# EAGLE design db9midi (EAGLE 9.0.0)
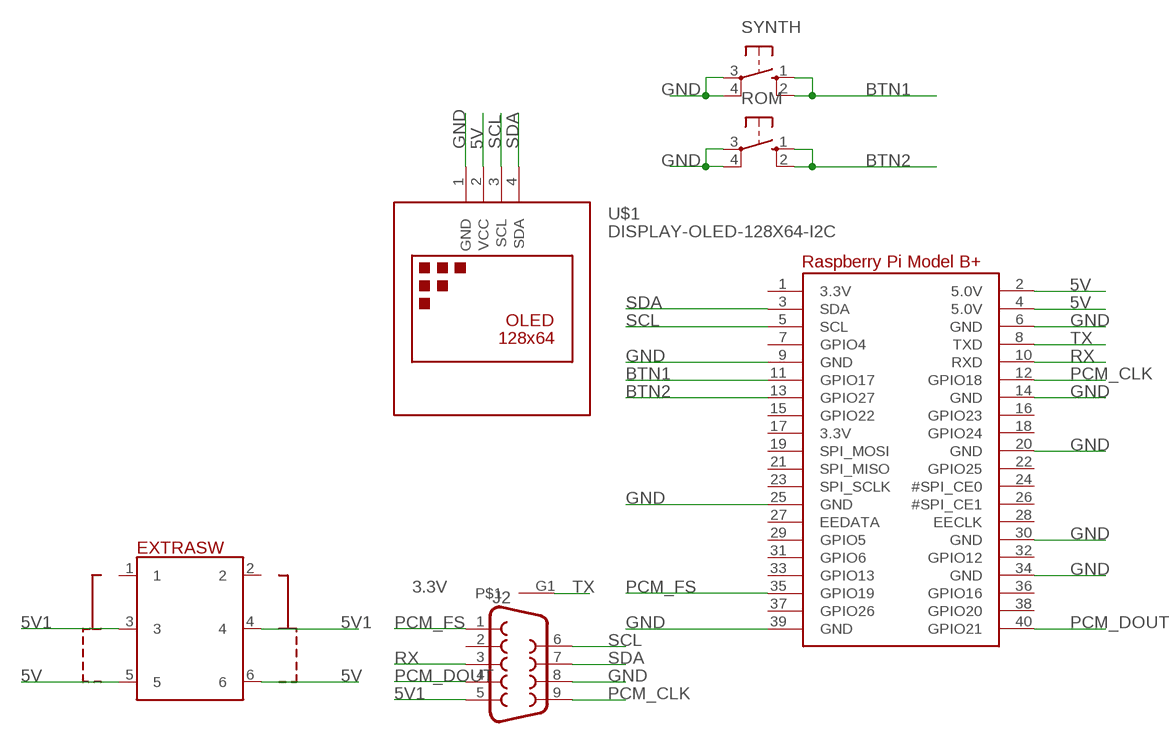
[diagram p0: schematic, sheet 1]

## Parts
EXTRASW  PS-22F03  [PS-22F03]
J2  DB9FEMALE  [DB9]
ROM  SWITCH-OMRON_10-XX  [SWITCH-OMRON_B3F-10XX]
RPI1  RASPBERRYPI_BPLUS_HATNOSLOTS  [PI_HAT_NOSLOTS]
SYNTH  SWITCH-OMRON_10-XX  [SWITCH-OMRON_B3F-10XX]
U$1  DISPLAY-OLED-128X64-I2C  [DISPLAY-OLED-128X64-I2C]

## Nets
5V: EXTRASW.5 EXTRASW.6 RPI1.2(5.0V) RPI1.4(5.0V) U$1.2(VCC)
5V1: EXTRASW.3 EXTRASW.4 J2.5
BTN1: RPI1.11(GPIO17) SYNTH.1(S) SYNTH.2(S1)
BTN2: ROM.1(S) ROM.2(S1) RPI1.13(GPIO27)
GND: J2.8 ROM.3(P) ROM.4(P1) RPI1.6(GND) RPI1.9(GND) RPI1.14(GND) RPI1.20(GND) RPI1.25(GND) RPI1.30(GND) RPI1.34(GND) RPI1.39(GND) SYNTH.3(P) SYNTH.4(P1) U$1.1(GND)
PCM_CLK: J2.9 RPI1.12(GPIO18)
PCM_DOUT: J2.4 RPI1.40(GPIO21)
PCM_FS: J2.1 RPI1.35(GPIO19)
RX: J2.3 RPI1.10(RXD)
SCL: J2.6 RPI1.5(SCL) U$1.3(SCL)
SDA: J2.7 RPI1.3(SDA) U$1.4(SDA)
TX: J2.G1 RPI1.8(TXD)
Unconnected: EXTRASW.1 EXTRASW.2 J2.2 RPI1.1(3.3V) RPI1.7(GPIO4) RPI1.15(GPIO22) RPI1.16(GPIO23) RPI1.17(3.3V) RPI1.18(GPIO24) RPI1.19(SPI_MOSI) RPI1.21(SPI_MISO) RPI1.22(GPIO25) RPI1.23(SPI_SCLK) RPI1.24(#SPI_CE0) RPI1.26(#SPI_CE1) RPI1.27(EEDATA) RPI1.28(EECLK) RPI1.29(GPIO5) RPI1.31(GPIO6) RPI1.32(GPIO12) RPI1.33(GPIO13) RPI1.36(GPIO16) RPI1.37(GPIO26) RPI1.38(GPIO20)

## Library data of the parts
EXTRASW = A03 PS-22F03:PS-22F03
J2 = SparkFun-Connectors:DB9: DB9 Connector Standard DB9 (D-Sub 9) serial connector. Can be used for CAN bus as well as RS485 and RS232. Footprint production proven. Here is the female version connector we sell at SparkFun: 9 Pin Female Serial Connector - PCB Mount <https://www.sparkfun.com/products/429> (PRT-00429) This connector has been used on the following SparkFun products: SparkFun RS232 Shifter - SMD <https://www.sparkfun.com/products/449> (PRT-00449) SparkFun RS232 Shifter SMD (No DB9) <https://www.sparkfun.com/products/8780> (PRT-08780); PROD_ID: CONN-08194
ROM SYNTH = mister_io_usb:SWITCH-OMRON_10-XX: OMRON SWITCH; MPN: B3F-1000; OC_FARNELL: 176432; OC_NEWARK: 36M3542
RPI1 = microbuilder:RASPBERRYPI_BPLUS
U$1 = diy-modules:DISPLAY-OLED-128X64-I2C: 128x64 Dot Matrix OLED Module based on SSD1306 chip Variant with I2C interface More details available here: http://www.instructables.com/id/Monochrome-096-i2c-OLED-display-with-arduino-SSD13/ SSD1306 datasheet: https://cdn-shop.adafruit.com/datasheets/SSD1306.pdf Click here to find device on ebay.com <http://www.ebay.com/sch/oled+display+128x64+iic> Note: There are two variants: I2C and SPI. Search for the proper version.

## Net classes
1 GND: width 0.254 mm
2 VCC: width 0.254 mm

## Board
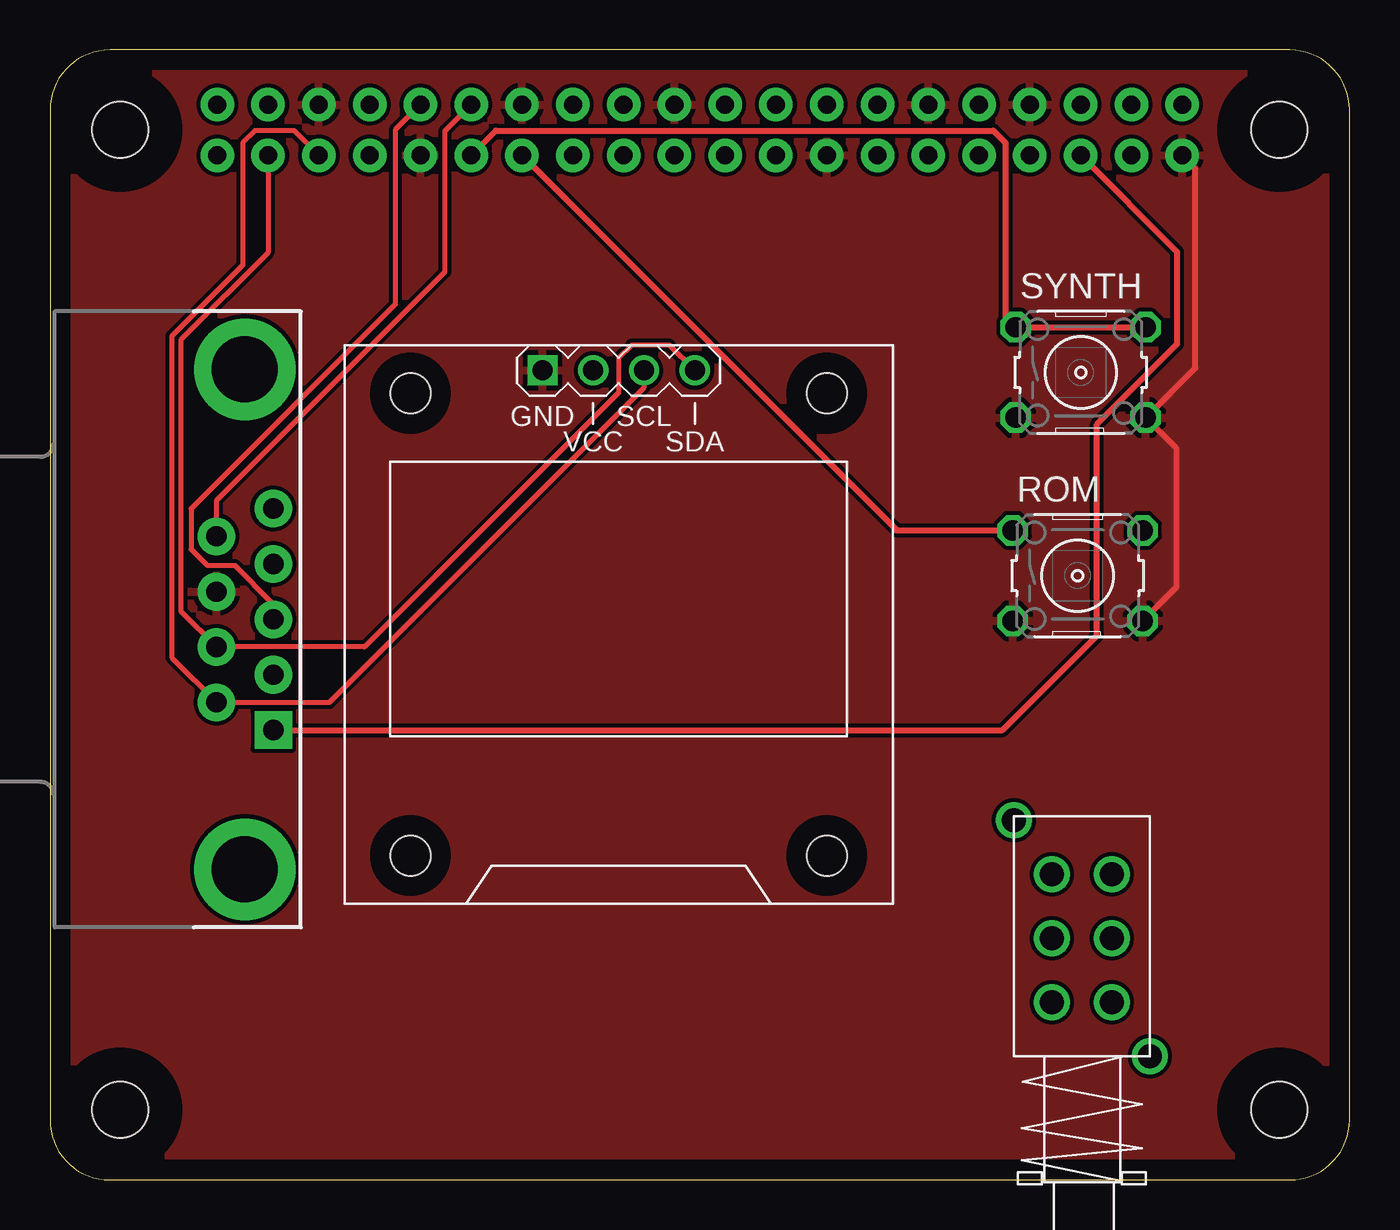
[diagram p1: board, top side]
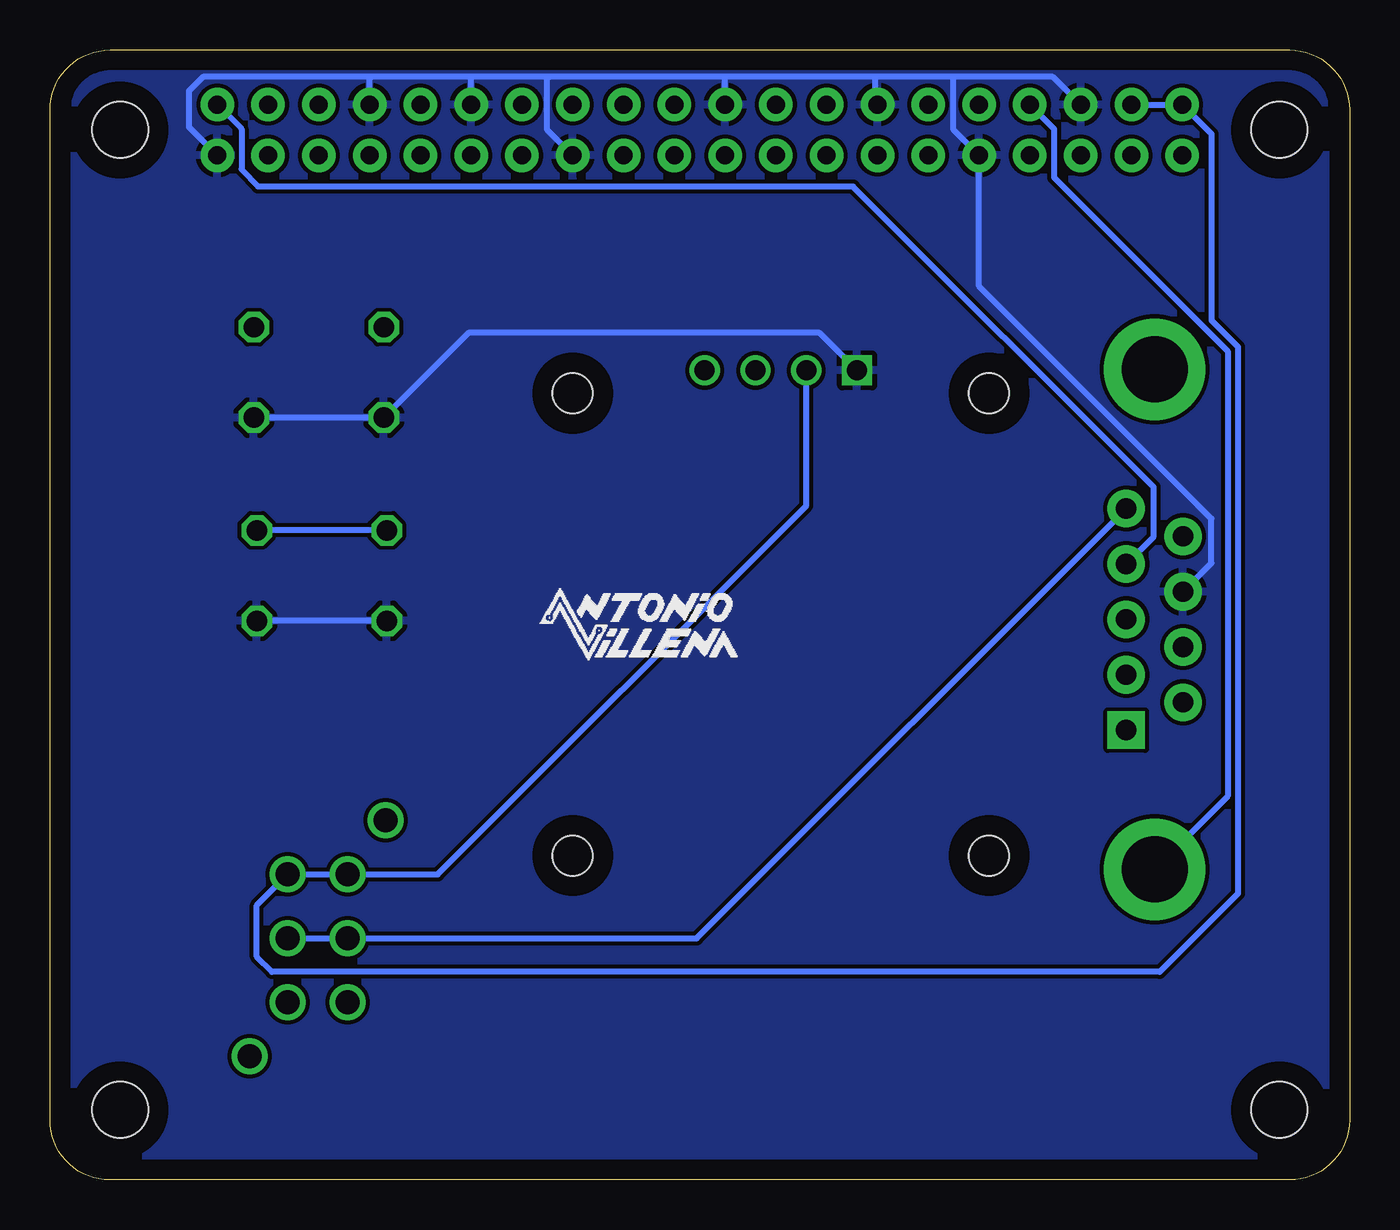
[diagram p2: board, bottom side, seen from below]

Size 65 x 56.5 mm. Coordinates in mm from the lower left corner, seen from the top.
Copper layers (1*16): Top 0.035mm / dielectric 1.5mm / Bottom 0.035mm
Design rules "default *": minimum track width 10mil, minimum drill 24mil, track to track 8mil, track to pad 8mil, pad to pad 8mil, via to via 8mil, smd to smd 8mil, copper to edge 40mil, drill to drill 8mil, minimum pad ring 10mil, minimum via ring 8mil, stop-mask expansion 4mil, vias tented up to drill 20mil, thermal gap 10mil

### Footprints (pad centres in the part's own frame; a part is rotated, then mirrored left to right if it is on the bottom)
PS-22F03 = drill 1.2: 1 -1.5,3.2; 2 1.5,3.2; 3 -1.5,0; 4 1.5,0; 5 -1.5,-3.2; 6 1.5,-3.2; P$1 -3.4,5.9; P$2 3.4,-5.9
DB9 = drill 1.016 pad 1.88 square: 1 -5.54,-1.42 | drill 1.016 pad 1.88: 2 -2.77,-1.42; 3 0,-1.42; 4 2.77,-1.42; 5 5.54,-1.42; 6 -4.15,1.42; 7 -1.38,1.42; 8 1.38,1.42; 9 4.15,1.42 | drill 3.302 pad 5.08: G1 -12.5,0; G2 12.5,0
SWITCH-OMRON_B3F-10XX = drill 1.016 octagon: 1 -3.251,2.261; 2 3.251,2.261; 3 -3.251,-2.261; 4 3.251,-2.261
PI_HAT_NOSLOTS = drill 0.9 pad 1.676: 1 8.37,51.23; 2 8.37,53.77; 3 10.91,51.23; 4 10.91,53.77; 5 13.45,51.23; 6 13.45,53.77; 7 15.99,51.23; 8 15.99,53.77; 9 18.53,51.23; 10 18.53,53.77; 11 21.07,51.23; 12 21.07,53.77; 13 23.61,51.23; 14 23.61,53.77; 15 26.15,51.23; 16 26.15,53.77; 17 28.69,51.23; 18 28.69,53.77; 19 31.23,51.23; 20 31.23,53.77; 21 33.77,51.23; 22 33.77,53.77; 23 36.31,51.23; 24 36.31,53.77; 25 38.85,51.23; 26 38.85,53.77; 27 41.39,51.23; 28 41.39,53.77; 29 43.93,51.23; 30 43.93,53.77; 31 46.47,51.23; 32 46.47,53.77; 33 49.01,51.23; 34 49.01,53.77; 35 51.55,51.23; 36 51.55,53.77; 37 54.09,51.23; 38 54.09,53.77; 39 56.63,51.23; 40 56.63,53.77 | hole 2.8: 3.5,3.5; 3.5,52.5; 61.5,52.5; 61.5,3.5
DISPLAY-OLED-128X64-I2C = drill 1 square: 1 -3.81,12.7 | drill 1: 2 -1.27,12.7; 3 1.27,12.7; 4 3.81,12.7 | hole 2: -10.414,11.557; 10.414,11.557; 10.414,-11.557; -10.414,-11.557

### Placement (x,y rotation side)
EXTRASW  51.61,12.08 180 top
J2  9.75,28.03 90 top
ROM  51.4,30.22 0 top
RPI1  0,0 0 top
SYNTH  51.56,40.38 0 top
U$1  28.44,27.78 0 top

### Tracks (layer width: path | path; a pad name or v marks a point on that pad's centre or on a via)
5V
  Bottom 0.305: U$1.2 27.17,33.72 45.61,15.28 EXTRASW.6 EXTRASW.5 54.65,13.73 54.65,11.17 53.89,10.41 9.49,10.41 5.58,14.32 5.58,41.66 6.9,42.98 6.9,52.3 RPI1.2 RPI1.4
5V1
  Bottom 0.305: EXTRASW.3 EXTRASW.4 32.66,12.08 J2.5
BTN1
  Top 0.305: RPI1.11 22.31,52.47 47.19,52.47 47.8,51.86 47.8,43.15 SYNTH.1 SYNTH.2
BTN2
  Top 0.305: RPI1.13 42.36,32.48 ROM.1
  Bottom 0.305: ROM.1 ROM.2
GND
  Top 0.305: RPI1.39 57.3,50.56 57.3,40.61 SYNTH.4 56.33,36.59 56.33,29.63 ROM.4
  Bottom 0.305: RPI1.6 14.84,55.16 19.81,55.16 | 19.81,55.16 23.72,55.16 | 23.72,55.16 31.24,55.16 | 31.24,55.16 40.02,55.16 | 40.02,55.16 43.94,55.16 | 43.94,55.16 49.12,55.16 | 49.12,55.16 57.35,55.16 58.06,54.45 58.06,52.66 RPI1.39 | RPI1.34 49.01,55.05 49.12,55.16 | RPI1.30 43.93,55.16 43.94,55.16 | RPI1.20 31.23,55.16 31.24,55.16 | RPI1.14 23.72,53.88 23.72,55.16 | 19.81,55.16 19.81,52.51 RPI1.9 18.53,44.69 6.9,33.06 6.9,30.84 J2.8 | RPI1.25 40.13,52.51 40.13,55.06 40.02,55.16 | SYNTH.4 SYNTH.3 44.06,42.36 26.51,42.36 U$1.1 | ROM.3 ROM.4
  pour Bottom: 0.41,56.07 64.6,56.13 64.42,0.65 0.59,0.53
  pour Top: 0.41,56.18 64.55,56.13 64.62,0.55 0.64,0.38
PCM_CLK
  Top 0.254: J2.9 8.33,33.98 19.76,45.41 19.76,52.46 RPI1.12
PCM_DOUT
  Bottom 0.305: J2.4 9.8,32.17 9.8,34.64 24.84,49.67 54.55,49.67 | 54.55,49.67 54.6,49.67 | RPI1.40 55.42,52.56 55.42,50.54 54.55,49.67
PCM_FS
  Top 0.305: J2.1 47.64,22.49 52.37,27.22 52.37,37.79 56.38,41.8 56.38,46.4 RPI1.35
RX
  Top 0.254: J2.3 11.17,28.8 9.24,30.73 7.87,30.73 7.06,31.54 7.06,33.57 17.27,43.78 17.27,52.51 RPI1.10
SCL
  Top 0.254: RPI1.5 12.21,52.47 10.26,52.47 9.65,51.86 9.65,45.75 6.09,42.19 6.09,26.12 J2.6 8.34,23.87 13.96,23.87 29.71,39.62 U$1.3
SDA
  Top 0.254: RPI1.3 10.91,46.37 6.55,42 6.55,28.43 J2.7 15.73,26.65 28.44,39.36 28.44,41.09 29.1,41.75 30.98,41.75 U$1.4
TX
  Bottom 0.305: RPI1.8 14.78,52.56 14.78,50.13 8.73,44.09 6.09,41.45 6.09,19.19 J2.G1